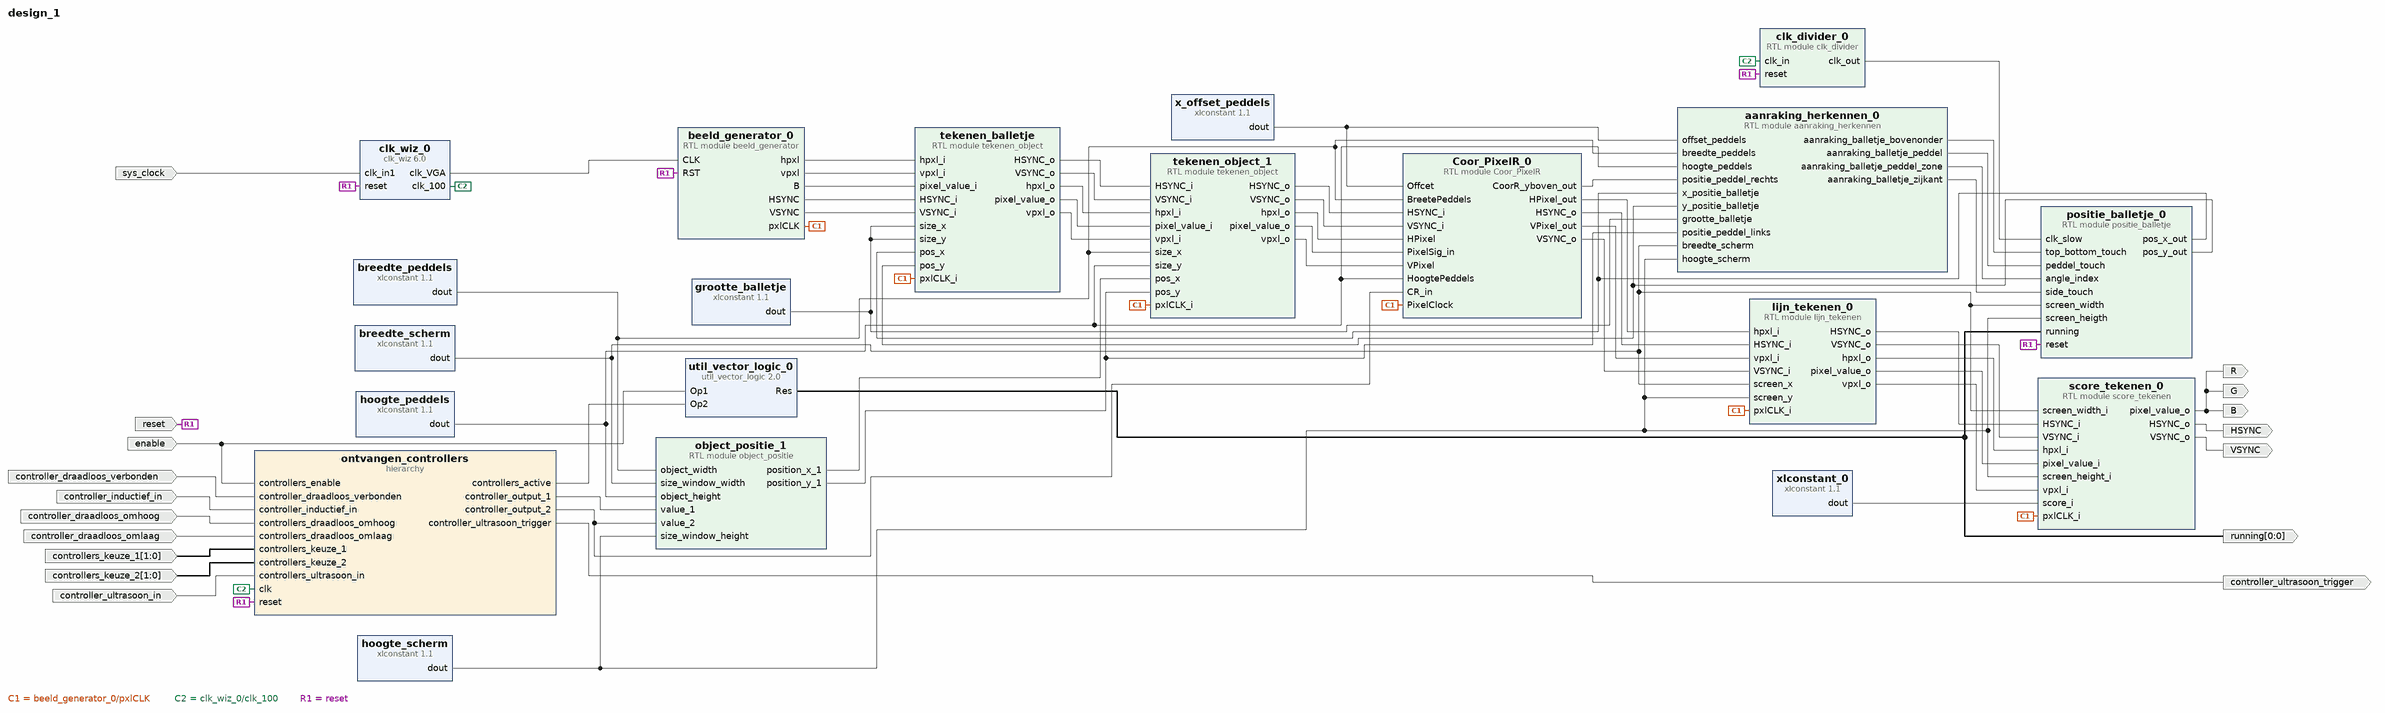
[diagram p0: block diagram of the top level]
# Vivado block design design_1, xc7z020clg400-1, Vivado 2023.1
create_bd_design design_1

create_bd_port -dir I -type rst reset
set_property -dict {CONFIG.POLARITY ACTIVE_HIGH} [get_bd_ports reset]
create_bd_port -dir I -type clk sys_clock
set_property -dict {CONFIG.FREQ_HZ 125000000 CONFIG.PHASE 0.0} [get_bd_ports sys_clock]
create_bd_port -dir I -from 1 -to 0 controllers_keuze_1
create_bd_port -dir I -from 1 -to 0 controllers_keuze_2
create_bd_port -dir I controller_inductief_in
create_bd_port -dir I controller_ultrasoon_in
create_bd_port -dir I controller_draadloos_verbonden
create_bd_port -dir I controller_draadloos_omhoog
create_bd_port -dir I controller_draadloos_omlaag
create_bd_port -dir O controller_ultrasoon_trigger
create_bd_port -dir I enable
create_bd_port -dir O HSYNC
create_bd_port -dir O VSYNC
create_bd_port -dir O B
create_bd_port -dir O R
create_bd_port -dir O G
create_bd_port -dir O -from 0 -to 0 running

create_bd_cell -type hier ontvangen_controllers
create_bd_cell -type ip -vlnv xilinx.com:ip:clk_wiz:6.0 clk_wiz_0
set_property -dict [list \
  CONFIG.CLKOUT2_JITTER 143.688 \
  CONFIG.CLKOUT2_PHASE_ERROR 96.948 \
  CONFIG.CLKOUT2_REQUESTED_OUT_FREQ 50 \
  CONFIG.CLKOUT2_USED true \
  CONFIG.CLK_IN1_BOARD_INTERFACE sys_clock \
  CONFIG.CLK_OUT1_PORT clk_100 \
  CONFIG.CLK_OUT2_PORT clk_VGA \
  CONFIG.MMCM_CLKOUT1_DIVIDE 20 \
  CONFIG.NUM_OUT_CLKS 2 \
  CONFIG.USE_BOARD_FLOW true \
  CONFIG.USE_LOCKED false \
  CONFIG.USE_RESET true \
] [get_bd_cells clk_wiz_0]
create_bd_cell -type ip -vlnv xilinx.com:ip:xlconstant:1.1 breedte_scherm
set_property -dict {CONFIG.CONST_VAL 640 CONFIG.CONST_WIDTH 10} [get_bd_cells breedte_scherm]
create_bd_cell -type ip -vlnv xilinx.com:ip:xlconstant:1.1 hoogte_scherm
set_property -dict {CONFIG.CONST_VAL 480 CONFIG.CONST_WIDTH 10} [get_bd_cells hoogte_scherm]
create_bd_cell -type ip -vlnv xilinx.com:ip:xlconstant:1.1 hoogte_peddels
set_property -dict {CONFIG.CONST_VAL 80 CONFIG.CONST_WIDTH 10} [get_bd_cells hoogte_peddels]
create_bd_cell -type ip -vlnv xilinx.com:ip:xlconstant:1.1 breedte_peddels
set_property -dict {CONFIG.CONST_VAL 20 CONFIG.CONST_WIDTH 10} [get_bd_cells breedte_peddels]
create_bd_cell -type ip -vlnv xilinx.com:ip:xlconstant:1.1 grootte_balletje
set_property -dict {CONFIG.CONST_VAL 8 CONFIG.CONST_WIDTH 10} [get_bd_cells grootte_balletje]
create_bd_cell -type ip -vlnv xilinx.com:ip:util_vector_logic:2.0 util_vector_logic_0
set_property -dict {CONFIG.C_SIZE 1} [get_bd_cells util_vector_logic_0]
create_bd_cell -type module -reference clk_divider clk_divider_0
set_property -dict {CONFIG.division 750000} [get_bd_cells clk_divider_0]
create_bd_cell -type module -reference object_positie object_positie_1
create_bd_cell -type module -reference beeld_generator beeld_generator_0
create_bd_cell -type module -reference positie_balletje positie_balletje_0
create_bd_cell -type module -reference tekenen_object tekenen_balletje
create_bd_cell -type module -reference tekenen_object tekenen_object_1
create_bd_cell -type module -reference lijn_tekenen lijn_tekenen_0
set_property -dict {CONFIG.width_line 5} [get_bd_cells lijn_tekenen_0]
create_bd_cell -type ip -vlnv xilinx.com:ip:xlconstant:1.1 x_offset_peddels
set_property -dict {CONFIG.CONST_VAL 1 CONFIG.CONST_WIDTH 10} [get_bd_cells x_offset_peddels]
create_bd_cell -type module -reference aanraking_herkennen aanraking_herkennen_0
create_bd_cell -type module -reference Coor_PixelR Coor_PixelR_0
create_bd_cell -type ip -vlnv xilinx.com:ip:xlconstant:1.1 xlconstant_0
set_property -dict {CONFIG.CONST_VAL 2 CONFIG.CONST_WIDTH 4} [get_bd_cells xlconstant_0]
create_bd_cell -type module -reference score_tekenen score_tekenen_0

# ---- hierarchy /ontvangen_controllers ----
current_bd_instance /ontvangen_controllers
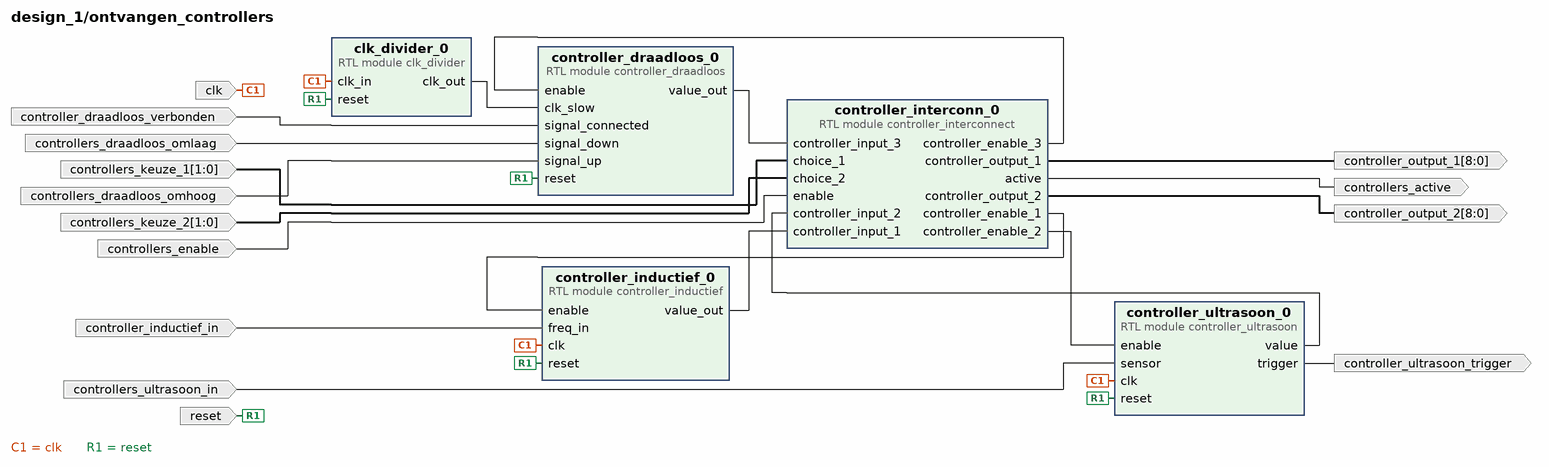
[diagram p1: block diagram inside /ontvangen_controllers]
create_bd_pin -dir I controllers_enable
create_bd_pin -dir I -from 1 -to 0 controllers_keuze_1
create_bd_pin -dir I -from 1 -to 0 controllers_keuze_2
create_bd_pin -dir O controllers_active
create_bd_pin -dir I controller_inductief_in
create_bd_pin -dir I controllers_ultrasoon_in
create_bd_pin -dir I controller_draadloos_verbonden
create_bd_pin -dir I controllers_draadloos_omhoog
create_bd_pin -dir I controllers_draadloos_omlaag
create_bd_pin -dir I -type rst reset
create_bd_pin -dir O controller_ultrasoon_trigger
create_bd_pin -dir I clk
create_bd_pin -dir O -from 8 -to 0 controller_output_1
create_bd_pin -dir O -from 8 -to 0 controller_output_2

create_bd_cell -type module -reference controller_draadloos controller_draadloos_0
create_bd_cell -type module -reference clk_divider clk_divider_0
set_property -dict {CONFIG.division 200000} [get_bd_cells clk_divider_0]
create_bd_cell -type module -reference controller_interconnect controller_interconn_0
create_bd_cell -type module -reference controller_inductief controller_inductief_0
create_bd_cell -type module -reference controller_ultrasoon controller_ultrasoon_0

# ---- connections ----

current_bd_instance /ontvangen_controllers
connect_bd_net -net choice_1_0_1 [get_bd_pins controllers_keuze_1] [get_bd_pins controller_interconn_0/choice_1]
connect_bd_net -net choice_2_0_1 [get_bd_pins controllers_keuze_2] [get_bd_pins controller_interconn_0/choice_2]
connect_bd_net [get_bd_pins clk_divider_0/clk_out] [get_bd_pins controller_draadloos_0/clk_slow]
connect_bd_net -net clk_in_0_1 [get_bd_pins clk] \
  [get_bd_pins clk_divider_0/clk_in] [get_bd_pins controller_inductief_0/clk] [get_bd_pins controller_ultrasoon_0/clk]
connect_bd_net [get_bd_pins controller_draadloos_0/value_out] [get_bd_pins controller_interconn_0/controller_input_3]
connect_bd_net [get_bd_pins controller_inductief_0/value_out] [get_bd_pins controller_interconn_0/controller_input_1]
connect_bd_net [get_bd_pins controller_interconn_0/active] [get_bd_pins controllers_active]
connect_bd_net [get_bd_pins controller_interconn_0/controller_enable_1] [get_bd_pins controller_inductief_0/enable]
connect_bd_net [get_bd_pins controller_interconn_0/controller_enable_2] [get_bd_pins controller_ultrasoon_0/enable]
connect_bd_net [get_bd_pins controller_interconn_0/controller_enable_3] [get_bd_pins controller_draadloos_0/enable]
connect_bd_net [get_bd_pins controller_interconn_0/controller_output_1] [get_bd_pins controller_output_1]
connect_bd_net [get_bd_pins controller_interconn_0/controller_output_2] [get_bd_pins controller_output_2]
connect_bd_net [get_bd_pins controller_ultrasoon_0/trigger] [get_bd_pins controller_ultrasoon_trigger]
connect_bd_net [get_bd_pins controller_ultrasoon_0/value] [get_bd_pins controller_interconn_0/controller_input_2]
connect_bd_net -net enable_0_1 [get_bd_pins controllers_enable] [get_bd_pins controller_interconn_0/enable]
connect_bd_net -net freq_in_0_1 [get_bd_pins controller_inductief_in] [get_bd_pins controller_inductief_0/freq_in]
connect_bd_net -net reset_0_1 [get_bd_pins reset] \
  [get_bd_pins controller_draadloos_0/reset] [get_bd_pins clk_divider_0/reset] [get_bd_pins controller_inductief_0/reset] \
  [get_bd_pins controller_ultrasoon_0/reset]
connect_bd_net -net sensor_0_1 [get_bd_pins controllers_ultrasoon_in] [get_bd_pins controller_ultrasoon_0/sensor]
connect_bd_net -net signal_connected_0_1 [get_bd_pins controller_draadloos_verbonden] [get_bd_pins controller_draadloos_0/signal_connected]
connect_bd_net -net signal_down_0_1 [get_bd_pins controllers_draadloos_omlaag] [get_bd_pins controller_draadloos_0/signal_down]
connect_bd_net -net signal_up_0_1 [get_bd_pins controllers_draadloos_omhoog] [get_bd_pins controller_draadloos_0/signal_up]

current_bd_instance /
connect_bd_net [get_bd_pins Coor_PixelR_0/CoorR_yboven_out] [get_bd_pins aanraking_herkennen_0/positie_peddel_rechts]
connect_bd_net [get_bd_pins Coor_PixelR_0/HPixel_out] [get_bd_pins lijn_tekenen_0/hpxl_i]
connect_bd_net [get_bd_pins Coor_PixelR_0/HSYNC_o] [get_bd_pins lijn_tekenen_0/HSYNC_i]
connect_bd_net [get_bd_pins Coor_PixelR_0/VPixel_out] [get_bd_pins lijn_tekenen_0/vpxl_i]
connect_bd_net [get_bd_pins Coor_PixelR_0/VSYNC_o] [get_bd_pins lijn_tekenen_0/VSYNC_i]
connect_bd_net [get_bd_pins beeld_generator_0/hpxl] [get_bd_pins tekenen_balletje/hpxl_i]
connect_bd_net [get_bd_pins beeld_generator_0/vpxl] [get_bd_pins tekenen_balletje/vpxl_i]
connect_bd_net [get_bd_pins aanraking_herkennen_0/aanraking_balletje_bovenonder] [get_bd_pins positie_balletje_0/top_bottom_touch]
connect_bd_net [get_bd_pins aanraking_herkennen_0/aanraking_balletje_peddel] [get_bd_pins positie_balletje_0/peddel_touch]
connect_bd_net [get_bd_pins aanraking_herkennen_0/aanraking_balletje_peddel_zone] [get_bd_pins positie_balletje_0/angle_index]
connect_bd_net [get_bd_pins aanraking_herkennen_0/aanraking_balletje_zijkant] [get_bd_pins positie_balletje_0/side_touch]
connect_bd_net [get_bd_pins beeld_generator_0/B] [get_bd_pins tekenen_balletje/pixel_value_i]
connect_bd_net [get_bd_pins beeld_generator_0/HSYNC] [get_bd_pins tekenen_balletje/HSYNC_i]
connect_bd_net [get_bd_pins beeld_generator_0/VSYNC] [get_bd_pins tekenen_balletje/VSYNC_i]
connect_bd_net [get_bd_pins beeld_generator_0/pxlCLK] \
  [get_bd_pins tekenen_balletje/pxlCLK_i] [get_bd_pins tekenen_object_1/pxlCLK_i] [get_bd_pins lijn_tekenen_0/pxlCLK_i] \
  [get_bd_pins Coor_PixelR_0/PixelClock] [get_bd_pins score_tekenen_0/pxlCLK_i]
connect_bd_net [get_bd_pins breedte_peddels/dout] \
  [get_bd_pins object_positie_1/object_width] [get_bd_pins tekenen_object_1/size_x] \
  [get_bd_pins aanraking_herkennen_0/breedte_peddels] [get_bd_pins Coor_PixelR_0/BreetePeddels]
connect_bd_net [get_bd_pins breedte_scherm/dout] \
  [get_bd_pins object_positie_1/size_window_width] [get_bd_pins positie_balletje_0/screen_width] \
  [get_bd_pins lijn_tekenen_0/screen_x] [get_bd_pins aanraking_herkennen_0/breedte_scherm] \
  [get_bd_pins score_tekenen_0/screen_width_i]
connect_bd_net [get_bd_pins clk_divider_0/clk_out] [get_bd_pins positie_balletje_0/clk_slow]
connect_bd_net [get_bd_pins clk_wiz_0/clk_VGA] [get_bd_pins beeld_generator_0/CLK]
connect_bd_net -net clk_wiz_0_clk_out1 [get_bd_pins clk_wiz_0/clk_100] [get_bd_pins ontvangen_controllers/clk] [get_bd_pins clk_divider_0/clk_in]
connect_bd_net -net controller_draadloos_verbonden_0_1 [get_bd_ports controller_draadloos_verbonden] \
  [get_bd_pins ontvangen_controllers/controller_draadloos_verbonden]
connect_bd_net -net controller_inductief_in_0_1 [get_bd_ports controller_inductief_in] [get_bd_pins ontvangen_controllers/controller_inductief_in]
connect_bd_net -net controllers_draadloos_omhoog_0_1 [get_bd_ports controller_draadloos_omhoog] \
  [get_bd_pins ontvangen_controllers/controllers_draadloos_omhoog]
connect_bd_net -net controllers_draadloos_omlaag_0_1 [get_bd_ports controller_draadloos_omlaag] \
  [get_bd_pins ontvangen_controllers/controllers_draadloos_omlaag]
connect_bd_net -net controllers_enable_0_1 [get_bd_ports enable] \
  [get_bd_pins ontvangen_controllers/controllers_enable] [get_bd_pins util_vector_logic_0/Op1]
connect_bd_net -net controllers_keuze_1_0_1 [get_bd_ports controllers_keuze_1] [get_bd_pins ontvangen_controllers/controllers_keuze_1]
connect_bd_net -net controllers_keuze_2_0_1 [get_bd_ports controllers_keuze_2] [get_bd_pins ontvangen_controllers/controllers_keuze_2]
connect_bd_net -net controllers_ultrasoon_in_0_1 [get_bd_ports controller_ultrasoon_in] [get_bd_pins ontvangen_controllers/controllers_ultrasoon_in]
connect_bd_net [get_bd_pins grootte_balletje/dout] \
  [get_bd_pins tekenen_balletje/size_x] [get_bd_pins tekenen_balletje/size_y] \
  [get_bd_pins aanraking_herkennen_0/grootte_balletje]
connect_bd_net [get_bd_pins hoogte_peddels/dout] \
  [get_bd_pins object_positie_1/object_height] [get_bd_pins tekenen_object_1/size_y] \
  [get_bd_pins aanraking_herkennen_0/hoogte_peddels] [get_bd_pins Coor_PixelR_0/HoogtePeddels]
connect_bd_net [get_bd_pins lijn_tekenen_0/HSYNC_o] [get_bd_pins score_tekenen_0/HSYNC_i]
connect_bd_net [get_bd_pins lijn_tekenen_0/VSYNC_o] [get_bd_pins score_tekenen_0/VSYNC_i]
connect_bd_net [get_bd_pins lijn_tekenen_0/hpxl_o] [get_bd_pins score_tekenen_0/hpxl_i]
connect_bd_net [get_bd_pins lijn_tekenen_0/pixel_value_o] [get_bd_pins score_tekenen_0/pixel_value_i]
connect_bd_net [get_bd_pins lijn_tekenen_0/vpxl_o] [get_bd_pins score_tekenen_0/vpxl_i]
connect_bd_net [get_bd_pins object_positie_1/position_x_1] [get_bd_pins tekenen_object_1/pos_x]
connect_bd_net [get_bd_pins object_positie_1/position_y_1] \
  [get_bd_pins tekenen_object_1/pos_y] [get_bd_pins aanraking_herkennen_0/positie_peddel_links]
connect_bd_net -net offset_dout [get_bd_pins x_offset_peddels/dout] \
  [get_bd_pins aanraking_herkennen_0/offset_peddels] [get_bd_pins Coor_PixelR_0/Offcet]
connect_bd_net [get_bd_pins ontvangen_controllers/controller_output_1] [get_bd_pins object_positie_1/value_1]
connect_bd_net [get_bd_pins ontvangen_controllers/controller_output_2] [get_bd_pins object_positie_1/value_2] [get_bd_pins Coor_PixelR_0/CR_in]
connect_bd_net [get_bd_pins ontvangen_controllers/controller_ultrasoon_trigger] [get_bd_ports controller_ultrasoon_trigger]
connect_bd_net [get_bd_pins ontvangen_controllers/controllers_active] [get_bd_pins util_vector_logic_0/Op2]
connect_bd_net [get_bd_pins positie_balletje_0/pos_x_out] [get_bd_pins tekenen_balletje/pos_x] [get_bd_pins aanraking_herkennen_0/x_positie_balletje]
connect_bd_net [get_bd_pins positie_balletje_0/pos_y_out] [get_bd_pins tekenen_balletje/pos_y] [get_bd_pins aanraking_herkennen_0/y_positie_balletje]
connect_bd_net -net reset_0_1 [get_bd_ports reset] \
  [get_bd_pins ontvangen_controllers/reset] [get_bd_pins clk_divider_0/reset] [get_bd_pins clk_wiz_0/reset] \
  [get_bd_pins beeld_generator_0/RST] [get_bd_pins positie_balletje_0/reset]
connect_bd_net -net scherm_hoogte_dout [get_bd_pins hoogte_scherm/dout] \
  [get_bd_pins object_positie_1/size_window_height] [get_bd_pins positie_balletje_0/screen_heigth] \
  [get_bd_pins lijn_tekenen_0/screen_y] [get_bd_pins aanraking_herkennen_0/hoogte_scherm] \
  [get_bd_pins score_tekenen_0/screen_height_i]
connect_bd_net [get_bd_pins score_tekenen_0/HSYNC_o] [get_bd_ports HSYNC]
connect_bd_net [get_bd_pins score_tekenen_0/VSYNC_o] [get_bd_ports VSYNC]
connect_bd_net [get_bd_pins score_tekenen_0/pixel_value_o] [get_bd_ports G] [get_bd_ports R] [get_bd_ports B]
connect_bd_net [get_bd_ports sys_clock] [get_bd_pins clk_wiz_0/clk_in1]
connect_bd_net [get_bd_pins tekenen_balletje/HSYNC_o] [get_bd_pins tekenen_object_1/HSYNC_i]
connect_bd_net [get_bd_pins tekenen_balletje/VSYNC_o] [get_bd_pins tekenen_object_1/VSYNC_i]
connect_bd_net [get_bd_pins tekenen_balletje/hpxl_o] [get_bd_pins tekenen_object_1/hpxl_i]
connect_bd_net [get_bd_pins tekenen_balletje/pixel_value_o] [get_bd_pins tekenen_object_1/pixel_value_i]
connect_bd_net [get_bd_pins tekenen_balletje/vpxl_o] [get_bd_pins tekenen_object_1/vpxl_i]
connect_bd_net [get_bd_pins tekenen_object_1/HSYNC_o] [get_bd_pins Coor_PixelR_0/HSYNC_i]
connect_bd_net [get_bd_pins tekenen_object_1/VSYNC_o] [get_bd_pins Coor_PixelR_0/VSYNC_i]
connect_bd_net [get_bd_pins tekenen_object_1/hpxl_o] [get_bd_pins Coor_PixelR_0/HPixel]
connect_bd_net [get_bd_pins tekenen_object_1/pixel_value_o] [get_bd_pins Coor_PixelR_0/PixelSig_in]
connect_bd_net [get_bd_pins tekenen_object_1/vpxl_o] [get_bd_pins Coor_PixelR_0/VPixel]
connect_bd_net [get_bd_pins util_vector_logic_0/Res] [get_bd_ports running] [get_bd_pins positie_balletje_0/running]
connect_bd_net [get_bd_pins xlconstant_0/dout] [get_bd_pins score_tekenen_0/score_i]

validate_bd_design
save_bd_design
